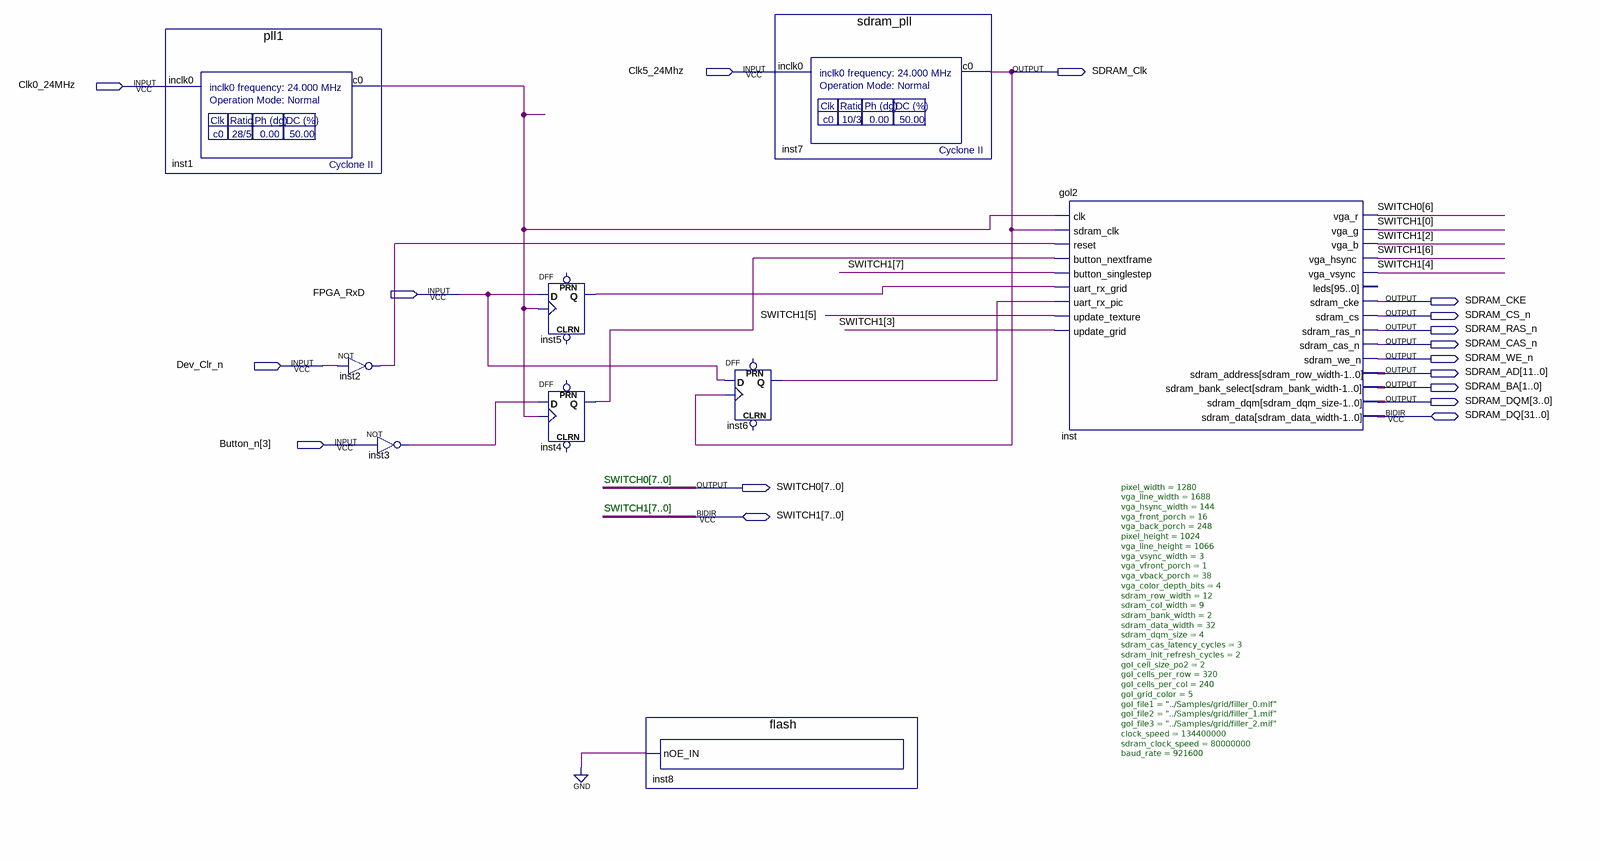
[diagram p0: schematic sheet]
// Quartus schematic gameoflife_sdram.bdf as structural Verilog: 9 symbols, 17 pins
module gameoflife_sdram (
  input  Clk5_24Mhz,
  input  Clk0_24MHz,
  input  FPGA_RxD,
  input  Dev_Clr_n,
  input  [3:3] Button_n,
  inout  [31:0] SDRAM_DQ,
  inout  [7:0] SWITCH1,
  output SDRAM_Clk,
  output SDRAM_CKE,
  output SDRAM_CS_n,
  output SDRAM_RAS_n,
  output SDRAM_CAS_n,
  output SDRAM_WE_n,
  output [11:0] SDRAM_AD,
  output [1:0] SDRAM_BA,
  output [3:0] SDRAM_DQM,
  output [7:0] SWITCH0
);

  wire inst1_c0, inst2_out, inst3_out, inst4_q, inst5_q, inst6_q;

  pll1 inst1 (.inclk0(Clk0_24MHz), .c0(inst1_c0));
  not inst2 (inst2_out, Dev_Clr_n);
  not inst3 (inst3_out, Button_n[3]);
  DFF inst5 (.CLK(inst1_c0), .D(FPGA_RxD), .Q(inst5_q));  // open: CLRN, PRN
  DFF inst4 (.CLK(inst1_c0), .D(inst3_out), .Q(inst4_q));  // open: CLRN, PRN
  flash inst8 (.nOE_IN(1'b0));
  DFF inst6 (.CLK(SDRAM_Clk), .D(FPGA_RxD), .Q(inst6_q));  // open: CLRN, PRN
  sdram_pll inst7 (.inclk0(Clk5_24Mhz), .c0(SDRAM_Clk));
  gol2 #(.pixel_width(1280), .vga_line_width(1688), .vga_hsync_width(144), .vga_front_porch(16), .vga_back_porch(248), .pixel_height(1024), .vga_line_height(1066), .vga_vsync_width(3), .vga_vfront_porch(1), .vga_vback_porch(38), .vga_color_depth_bits(4), .sdram_row_width(12), .sdram_col_width(9), .sdram_bank_width(2), .sdram_data_width(32), .sdram_dqm_size(4), .sdram_cas_latency_cycles(3), .sdram_init_refresh_cycles(2), .gol_cell_size_po2(2), .gol_cells_per_row(320), .gol_cells_per_col(240), .gol_grid_color(5), .gol_file1("../Samples/grid/filler_0.mif"), .gol_file2("../Samples/grid/filler_1.mif"), .gol_file3("../Samples/grid/filler_2.mif"), .clock_speed(134400000), .sdram_clock_speed(80000000), .baud_rate(921600)) inst (
    .clk(inst1_c0), .sdram_clk(SDRAM_Clk), .reset(inst2_out), .button_nextframe(inst4_q),
    .button_singlestep(SWITCH1[7]), .uart_rx_grid(inst5_q), .uart_rx_pic(inst6_q),
    .update_texture(SWITCH1[5]), .update_grid(SWITCH1[3]), .vga_r(SWITCH0[6]), .vga_g(SWITCH1[0]),
    .vga_b(SWITCH1[2]), .vga_hsync(SWITCH1[6]), .vga_vsync(SWITCH1[4]), .sdram_cke(SDRAM_CKE),
    .sdram_cs(SDRAM_CS_n), .sdram_ras_n(SDRAM_RAS_n), .sdram_cas_n(SDRAM_CAS_n), .sdram_we_n(SDRAM_WE_n),
    .sdram_address(SDRAM_AD), .sdram_bank_select(SDRAM_BA), .sdram_dqm(SDRAM_DQM), .sdram_data(SDRAM_DQ));  // open: leds

  // Notes on the sheet:
  //   SWITCH0[7..0]
  //   SWITCH1[7..0]
endmodule
